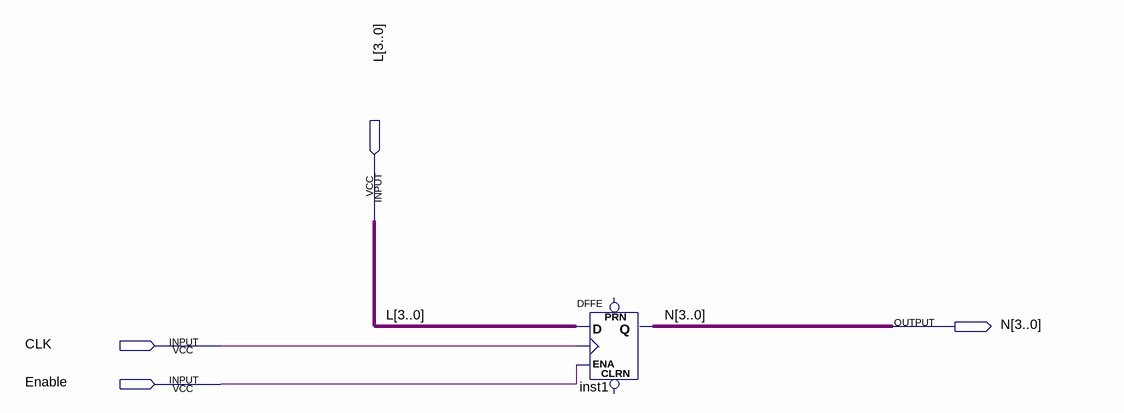
[diagram p0: schematic sheet]
// Quartus schematic Load.bdf as structural Verilog: 1 symbols, 4 pins
module Load (
  input  [3:0] L,
  input  CLK,
  input  Enable,
  output [3:0] N
);

  DFFE inst1[3:0] (.D(L), .CLK(CLK), .ENA(Enable), .Q(N));  // open: PRN, CLRN
endmodule
